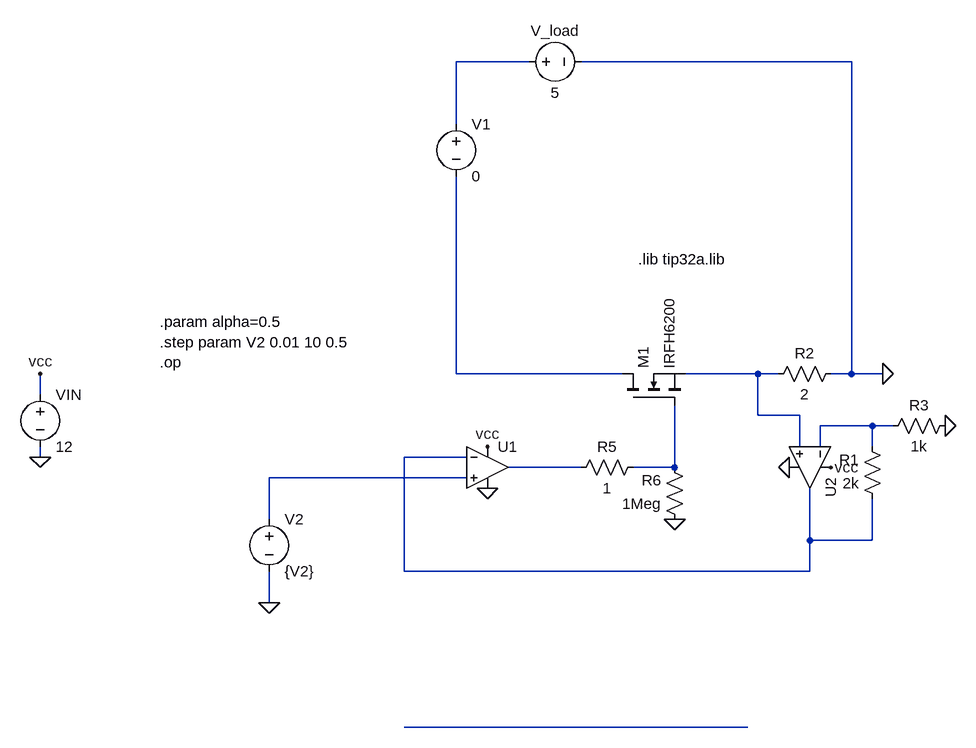
[diagram p0: schematic carga_activa rail to rail.asc]
carga_activa rail to rail.asc, the LTspice schematic file:
Version 4
SHEET 1 2888 1972
WIRE 576 -384 464 -384
WIRE 1072 -384 656 -384
WIRE 464 -288 464 -384
WIRE 464 96 464 -208
WIRE 720 96 464 96
WIRE 928 96 816 96
WIRE 960 96 928 96
WIRE 1072 96 1072 -384
WIRE 1072 96 1040 96
WIRE 1120 96 1072 96
WIRE -176 128 -176 96
WIRE 928 160 928 96
WIRE 992 160 928 160
WIRE 1104 176 1024 176
WIRE 1136 176 1104 176
WIRE 992 208 992 160
WIRE 1024 208 1024 176
WIRE 1104 208 1104 176
WIRE -176 224 -176 208
WIRE 480 224 384 224
WIRE 656 240 544 240
WIRE 800 240 800 144
WIRE 800 240 736 240
WIRE 480 256 176 256
WIRE 176 320 176 256
WIRE 1008 352 1008 272
WIRE 1104 352 1104 288
WIRE 1104 352 1008 352
WIRE 384 400 384 224
WIRE 1008 400 1008 352
WIRE 1008 400 384 400
WIRE 176 448 176 400
WIRE 912 640 384 640
FLAG -176 224 0
FLAG 176 448 0
FLAG 512 272 0
FLAG -176 96 vcc
FLAG 512 208 vcc
FLAG 800 320 0
FLAG 1120 96 0
FLAG 1216 176 0
FLAG 1040 240 vcc
FLAG 976 240 0
DATAFLAG 576 96 ""
SYMBOL voltage -176 112 R0
WINDOW 123 0 0 Left 0
WINDOW 39 0 0 Left 0
SYMATTR InstName VIN
SYMATTR Value 12
SYMBOL voltage 176 304 R0
WINDOW 123 0 0 Left 0
WINDOW 39 0 0 Left 0
SYMATTR InstName V2
SYMATTR Value {V2}
SYMBOL res 944 112 R270
WINDOW 0 32 56 VTop 2
WINDOW 3 0 56 VBottom 2
SYMATTR InstName R2
SYMATTR Value 2
SYMBOL voltage 560 -384 R270
WINDOW 0 32 56 VTop 2
WINDOW 3 -32 56 VBottom 2
WINDOW 123 0 0 Left 0
WINDOW 39 0 0 Left 0
SYMATTR InstName V_load
SYMATTR Value 5
SYMBOL nmos 720 144 R270
SYMATTR InstName M1
SYMATTR Value IRFH6200
SYMBOL res 752 224 R90
WINDOW 0 0 56 VBottom 2
WINDOW 3 32 56 VTop 2
SYMATTR InstName R5
SYMATTR Value 1
SYMBOL res 816 336 R180
WINDOW 0 36 76 Left 2
WINDOW 3 36 40 Left 2
SYMATTR InstName R6
SYMATTR Value 1Meg
SYMBOL OpAmps\\UniversalOpAmp2 512 240 R0
SYMATTR InstName U1
SYMBOL OpAmps\\UniversalOpAmp2 1008 240 R90
SYMATTR InstName U2
SYMBOL res 1120 304 R180
WINDOW 0 36 76 Left 2
WINDOW 3 36 40 Left 2
SYMATTR InstName R1
SYMATTR Value 2k
SYMBOL res 1120 192 R270
WINDOW 0 32 56 VTop 2
WINDOW 3 0 56 VBottom 2
SYMATTR InstName R3
SYMATTR Value 1k
SYMBOL voltage 464 -304 R0
WINDOW 123 0 0 Left 0
WINDOW 39 0 0 Left 0
SYMATTR InstName V1
SYMATTR Value 0
TEXT 744 -80 Left 2 !.lib tip32a.lib
TEXT 8 16 Left 2 !.param alpha=0.5\n.step param V2 0.01 10 0.5\n.op

The netlist it stands for:
* carga_activa rail to rail.asc
VIN vcc 0 12
V2 N008 0 {V2}
R2 N003 0 2
V_load N001 0 5
M1 N002 N007 N003 N003 IRFH6200
R5 N007 N006 1
R6 0 N007 1Meg
XU1 N008 N005 vcc 0 N006 level2 Avol=1Meg GBW=10Meg Slew=10Meg Ilimit=25m Rail=0 Vos=0 En=0 Enk=0 In=0 Ink=0 Rin=500Meg  ; pins In+ In- V+ V- OUT
XU2 N003 N004 vcc 0 N005 level2 Avol=1Meg GBW=10Meg Slew=10Meg Ilimit=25m Rail=0 Vos=0 En=0 Enk=0 In=0 Ink=0 Rin=500Meg  ; pins In+ In- V+ V- OUT
R1 N005 N004 2k
R3 N004 0 1k
V1 N001 N002 0
.model NMOS NMOS
.model PMOS PMOS
.lib standard.mos
.lib tip32a.lib
.param alpha=0.5
.step param V2 0.01 10 0.5
.op
.lib UniversalOpAmp2.lib
.backanno
.end